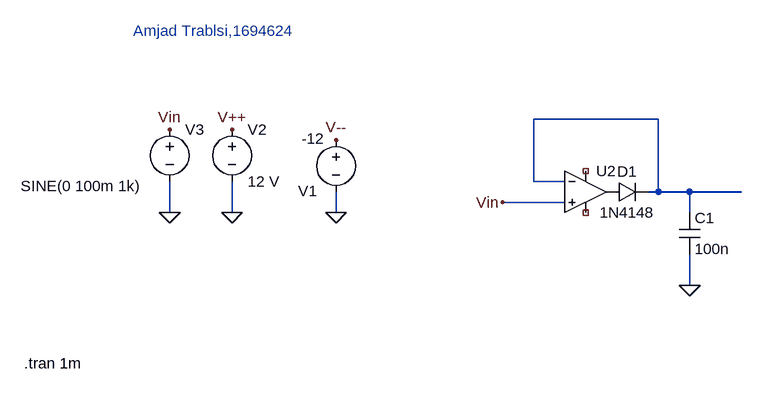
[diagram p0: schematic 4_4_SpitzenwertGR.asc]
4_4_SpitzenwertGR.asc, the LTspice schematic file:
Version 4
SHEET 1 996 680
WIRE 864 128 672 128
WIRE 672 224 672 128
WIRE 720 224 672 224
WIRE 864 240 864 128
WIRE 864 240 848 240
WIRE 912 240 864 240
WIRE 992 240 912 240
WIRE 720 256 624 256
WIRE 112 272 112 224
WIRE 208 272 208 224
WIRE 368 272 368 240
WIRE 912 272 912 240
WIRE 912 384 912 336
FLAG 208 272 0
FLAG 112 272 0
FLAG 112 144 Vin
FLAG 368 272 0
FLAG 368 160 V--
FLAG 208 144 V++
FLAG 912 384 0
FLAG 624 256 Vin
SYMBOL voltage 368 144 R0
WINDOW 0 -58 95 Left 2
WINDOW 3 -53 14 Left 2
WINDOW 123 0 0 Left 0
WINDOW 39 0 0 Left 0
SYMATTR InstName V1
SYMATTR Value -12
SYMBOL voltage 208 128 R0
WINDOW 123 0 0 Left 0
WINDOW 39 0 0 Left 0
SYMATTR InstName V2
SYMATTR Value 12 V
SYMBOL voltage 112 128 R0
WINDOW 3 -229 103 Left 2
WINDOW 123 0 0 Left 0
WINDOW 39 0 0 Left 0
SYMATTR InstName V3
SYMATTR Value SINE(0 100m 1k)
SYMBOL OpAmps\\UniversalOpAmp 752 240 R0
SYMATTR InstName U2
SYMBOL diode 784 256 R270
WINDOW 0 32 32 VTop 2
WINDOW 3 0 32 VBottom 2
SYMATTR InstName D1
SYMATTR Value 1N4148
SYMBOL cap 896 272 R0
SYMATTR InstName C1
SYMATTR Value 100n
TEXT 56 -8 Left 2 ;Amjad Trablsi,1694624
TEXT -112 504 Left 2 !.tran 1m

The netlist it stands for:
* 4_4_SpitzenwertGR.asc
V1 V-- 0 -12
V2 V++ 0 12 V
V3 Vin 0 SINE(0 100m 1k)
XU2 Vin N001 NC_01 NC_02 P001 level1 Avol=1Meg GBW=10Meg Vos=0 En=0 Enk=0 In=0 Ink=0 Rin=500Meg  ; pins In+ In- V+ V- OUT
D1 P001 N001 1N4148
C1 N001 0 100n
.model D D
.lib standard.dio
* Amjad Trablsi,1694624
.tran 1m
.lib UniversalOpAmp1.lib
.backanno
.end